# EAGLE board HPG_Solution_v1.0 (EAGLE 9.6.2), part 1 of 2
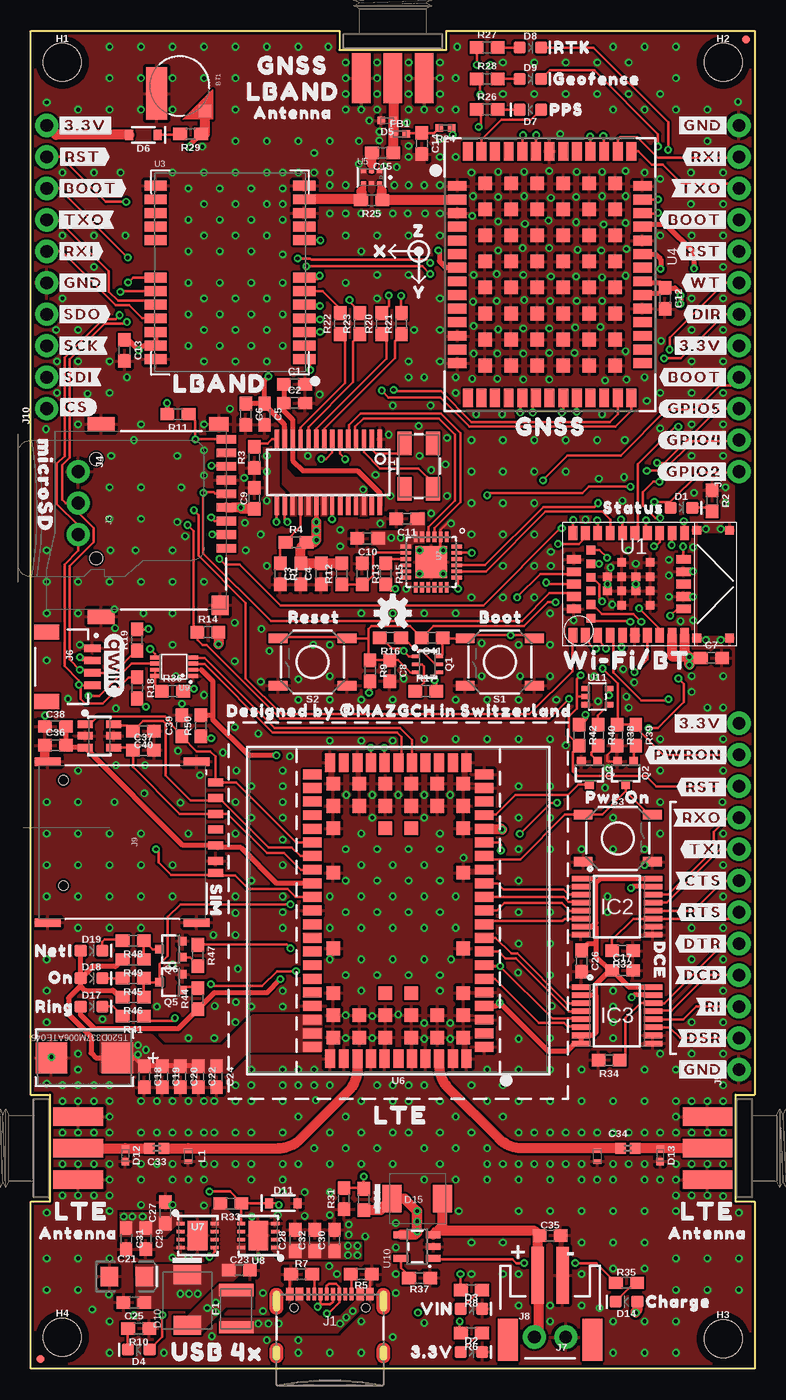
[diagram p2: board, top side]
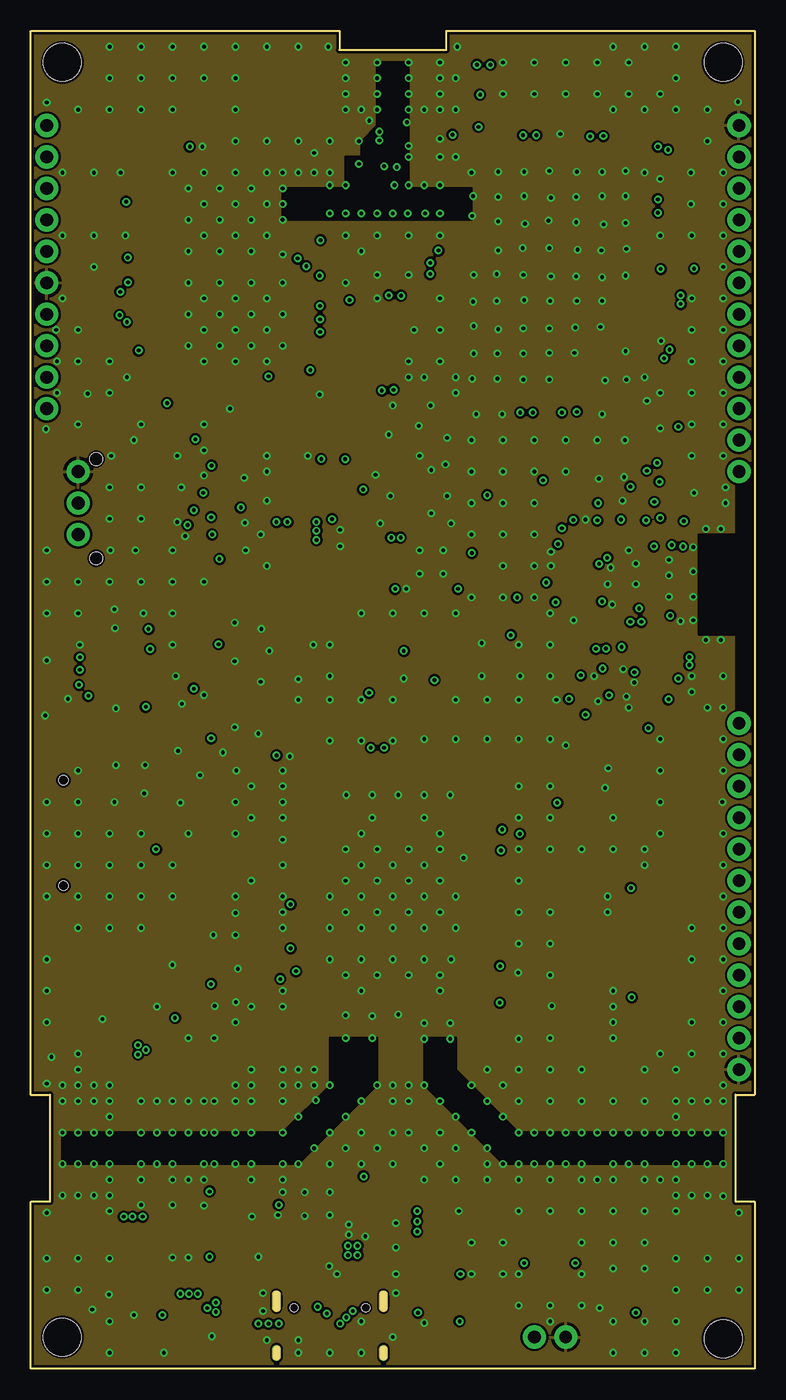
[diagram p3: board, inner layer Route2]
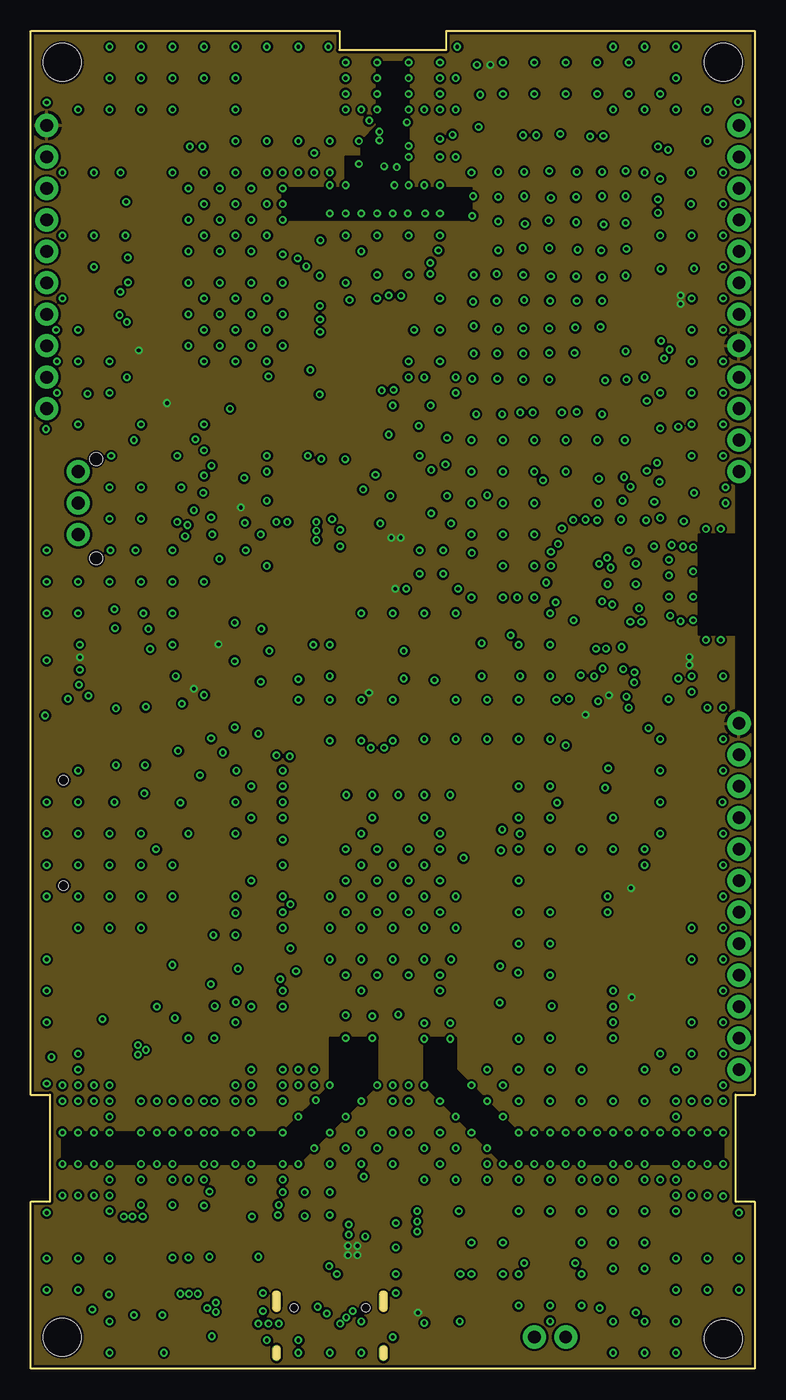
[diagram p4: board, inner layer Route15]
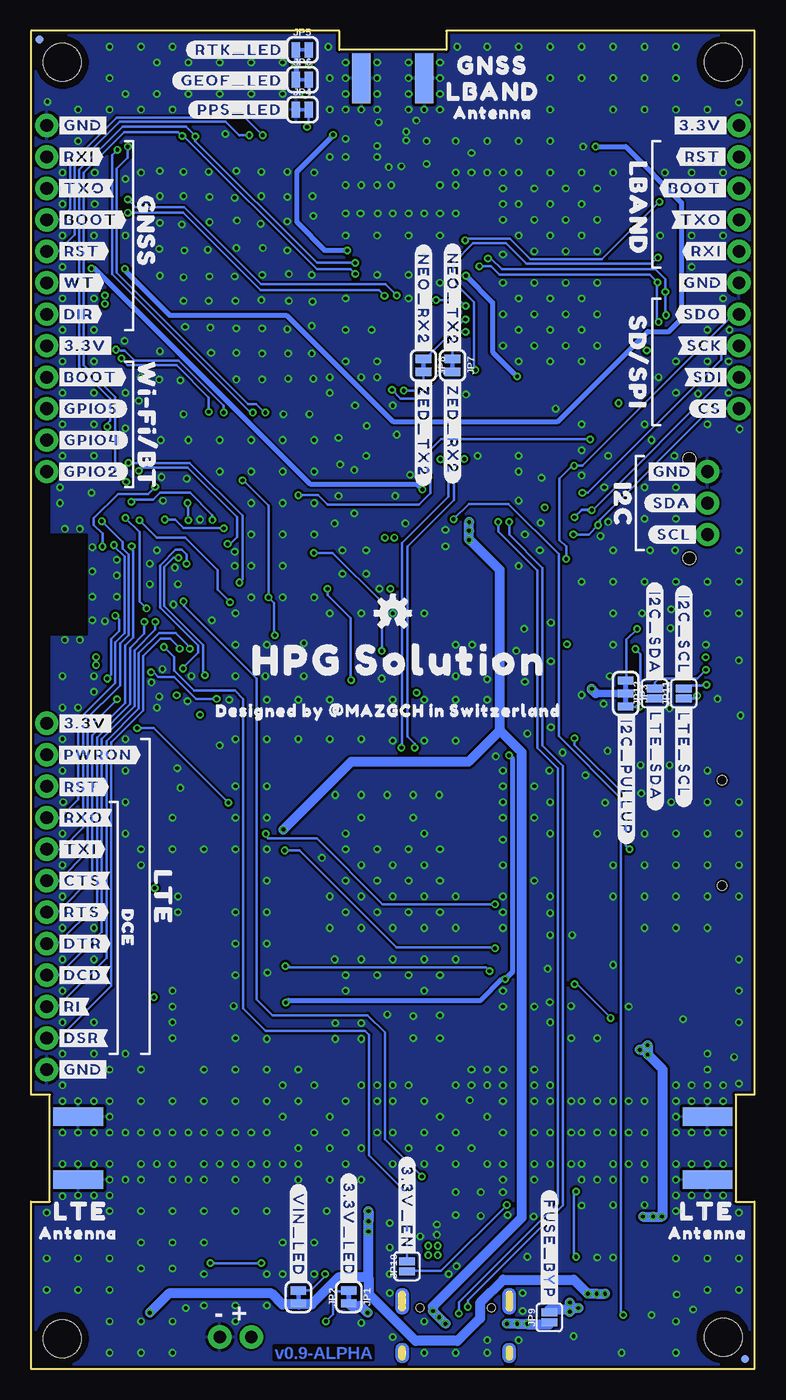
[diagram p5: board, bottom side, seen from below]

Size 58.42 x 107.95 mm. Coordinates in mm from the lower left corner, seen from the top.
Outline: 0,0 0,13.46 1.52,13.46 1.52,22.1 0,22.1 0,107.95 24.89,107.95 24.89,106.43 33.53,106.43 33.53,107.95 58.42,107.95 58.42,22.1 56.9,22.1 56.9,13.46 58.42,13.46 58.42,0 0,0
Copper layers (1+2*15+16): Top 0.035mm / dielectric 0.2mm / Route2 0.0175mm / dielectric 1.065mm / Route15 0.0175mm / dielectric 0.2mm / Bottom 0.035mm
Design rules "SparkFun-4-layer-1oz-JLCPCB": minimum track width 5mil, minimum drill 0.2mm, track to track 5mil, track to pad 0.2mm, pad to pad 5mil, via to via 0.2mm, smd to smd 0mil, copper to edge 0.2mm, drill to drill 10mil, minimum pad ring 0.13mm, minimum via ring 0.13mm, stop-mask expansion 0.05mm, vias tented up to drill 25mil, thermal gap 10mil
Net classes: 0 default: width 0.203 mm; 1 power: width 0.813 mm; 2 supply: width 0.406 mm; 3 RF: width 0.813 mm, clearance 0.127 mm; 4 DiffPair: width 0.152 mm, clearance 0.178 mm

## Footprints (pad centres in the part's own frame; a part is rotated, then mirrored left to right if it is on the bottom)
ML414H_IV01E = smd 1 x 1: + 2.022,2.032 | smd 4.2 x 1.7: - 0.6,-1.85
0603 = smd 1.1 x 1: 1 -0.85,0; 2 0.85,0
CAPMP7.6X4.3_3.1N_KEM = smd 2.56 x 2.5: 1 -2.672,0; 2 2.672,0
0603@1 = smd 1.1 x 1: 1 -0.85,0; 2 0.85,0
EIA3216 = smd 1.4 x 1.6: + 1.4,0; - -1.4,0
0402 = smd 0.85 x 0.9: 1 -0.58,0; 2 0.58,0
LED-0603 = smd 1 x 1: A -0.877,0; C 0.877,0
0402-TIGHT = smd 0.6 x 0.6: 1 -0.5,0; 2 0.5,0
SOD-323 = smd 0.63 x 0.83: A 1.15,0; C -1.15,0
DO-214BA = smd 1.52 x 2.21: A -2.032,0; C 2.038,0
SOT23-6L = smd 0.6 x 1.2: 1 -0.95,-1.15; 2 0,-1.15; 3 0.95,-1.15; 4 0.95,1.15; 5 0,1.15; 6 -0.95,1.15
SMA-EDGE = smd 1.5 x 4: GND@0 -2.54,0; GND@1 2.54,0; SIG 0,0 | smd 1.5 x 4 bottom: GND@2 -2.54,0; GND@3 2.54,0
1210 = smd 1 x 2.8: 1 -1.5,0; 2 1.5,0
FIDUCIAL-MICRO = smd 0.635 x 0.635: 1 0,0
STAND-OFF-TIGHT = hole 3.048: 0,0
FE1.1S_SSOP-28 = smd 0.35 x 1.5: 1 -4.16,-2.7; 2 -3.52,-2.7; 3 -2.88,-2.7; 4 -2.24,-2.7; 5 -1.6,-2.7; 6 -0.96,-2.7; 7 -0.32,-2.7; 8 0.32,-2.7; 9 0.96,-2.7; 10 1.6,-2.7; 11 2.24,-2.7; 12 2.88,-2.7; 13 3.52,-2.7; 14 4.16,-2.7; 15 4.16,2.7; 16 3.52,2.7; 17 2.88,2.7; 18 2.24,2.7; 19 1.6,2.7; 20 0.96,2.7; 21 0.32,2.7; 22 -0.3,2.7; 23 -0.96,2.7; 24 -1.6,2.7; 25 -2.24,2.7; 26 -2.88,2.7; 27 -3.52,2.7; 28 -4.16,2.7
SOP65P640X120-16N = smd 1.5 x 0.45: 1 -2.9,2.275; 2 -2.9,1.625; 3 -2.9,0.975; 4 -2.9,0.325; 5 -2.9,-0.325; 6 -2.9,-0.975; 7 -2.9,-1.625; 8 -2.9,-2.275; 9 2.9,-2.275; 10 2.9,-1.625; 11 2.9,-0.975; 12 2.9,-0.325; 13 2.9,0.325; 14 2.9,0.975; 15 2.9,1.625; 16 2.9,2.275
USB-C-16P_4LAYER-PADS = smd 0.3 x 1: A5 -1.25,-0.34; A6 -0.25,-0.34; A7 0.25,-0.34; A8 1.25,-0.34; B5 1.75,-0.34; B6 0.75,-0.34; B7 -0.75,-0.34; B8 -1.75,-0.34 | smd 0.6 x 1: GND -3.225,-0.34; GND2 3.225,-0.34; VBUS1 -2.45,-0.34; VBUS2 2.45,-0.34 | drill 0.4 pad 0.6 long: SHLD1 -4.318,-0.915; SHLD2 4.318,-0.915; SHLD3 -4.318,-5.095; SHLD4 4.318,-5.095 | hole 0.65: -2.89,-1.445; 2.89,-1.445
1X12_NO_SILK = drill 1.016 pad 1.88: 1 0,0; 2 2.54,0; 3 5.08,0; 4 7.62,0; 5 10.16,0; 6 12.7,0; 7 15.24,0; 8 17.78,0; 9 20.32,0; 10 22.86,0; 11 25.4,0; 12 27.94,0
MICROSD-EXTERNALPIN = smd 0.7 x 1.6: 1 2.25,10.5; 2 1.15,10.5; 3 0.05,10.5; 4 -1.05,10.5; 5 -2.15,10.5; 6 -3.25,10.5; 7 -4.35,10.5; 8 -5.45,10.5; 9 -6.55,10.5 | smd 1.2 x 1.6: 10 -7.75,9.9 | smd 1.2 x 2.2: 11 -7.75,0.4; 12 7.75,0.4 | smd 1.6 x 1.4: 13 6.85,10 | hole 1: 3.05,0; -4.95,0
1X03_NO_SILK = drill 1.016 pad 1.88: 1 0,0; 2 2.54,0; 3 5.08,0
JST04_1MM_RA = smd 0.6 x 1.35: 1 -1.5,0; 2 -0.5,0; 3 0.5,0; 4 1.5,0 | smd 1.2 x 2: NC1 2.8,-3.675; NC2 -2.8,-3.675
JST-2-SMD = smd 1 x 4.6: 1 -1,-3.7; 2 1,-3.7 | smd 1.6 x 3.4: NC1 -3.4,1.5; NC2 3.4,1.5
1X02_NO_SILK = drill 1.016 pad 1.88: 1 0,0; 2 2.54,0
NANO_SIM_PP = smd 0.7 x 2.1: A1 6.495,6; A2 -6.495,6; A3 -6.495,-6; A4 6.495,-6 | smd 0.65 x 1.23: C1 0.255,7.535; C2 -2.285,7.535; C3 -4.825,7.535; C5 1.525,7.535; C6 -1.015,7.535; C7 -3.555,7.535; CD 2.475,7.535 | hole 0.75: 3.505,-4.75; -4.995,-4.75
1X10_NO_SILK = drill 1.016 pad 1.88: 1 0,0; 2 2.54,0; 3 5.08,0; 4 7.62,0; 5 10.16,0; 6 12.7,0; 7 15.24,0; 8 17.78,0; 9 20.32,0; 10 22.86,0
SMT-JUMPER_2_NC_TRACE_SILK = smd 0.66 x 1.27: 1 -0.521,0; 2 0.521,0
SMT-JUMPER_3_2-NC_TRACE_SILK = smd 0.66 x 1.27: 1 -1.041,0; 2 0,0; 3 1.041,0
SMT-JUMPER_2_NO_SILK = smd 0.635 x 1.27: 1 -0.406,0; 2 0.406,0
0402_COILCRAFT = smd 0.356 x 0.66: P$1 -0.432,0; P$2 0.432,0
SC70-6 = smd 0.3 x 0.66: 1 -0.65,-0.92; 2 0,-0.92; 3 0.65,-0.92; 4 0.65,0.92; 5 0,0.92; 6 -0.65,0.92
SOT323 = smd 0.7 x 0.7: 1 -0.65,-0.925; 2 0.65,-0.925; 3 0,0.925
TACTILE_SWITCH_SMD_5.2MM = smd 1.524 x 0.762: 1 -2.794,1.905; 2 2.794,1.905; 3 -2.794,-1.905; 4 2.794,-1.905
NINA-W106 = smd 0.7 x 1.15: 1 4.95,4.125; 2 3.95,4.125; 3 2.95,4.125; 4 1.95,4.125; 5 0.95,4.125; 6 -0.05,4.125; 7 -1.05,4.125; 8 -2.05,4.125; 9 -3.05,4.125; 10 -4.05,4.125; 16 -4.05,-4.125; 17 -3.05,-4.125; 18 -2.05,-4.125; 19 -1.05,-4.125; 20 -0.05,-4.125; 21 0.95,-4.125; 22 1.95,-4.125; 23 2.95,-4.125; 24 3.95,-4.125; 25 4.95,-4.125 | smd 1.15 x 0.7: 11 -3.975,2; 12 -3.975,1; 13 -3.975,0; 14 -3.975,-1; 15 -3.975,-2; 26 4.875,-2; 27 4.875,-1; 28 4.875,0; 29 4.875,1; 30 4.875,2 | smd 0.7 x 0.7: 31 3.5,2.75; 32 3.5,1.65; 33 3.5,0.55; 34 3.5,-0.55; 35 3.5,-1.65; 36 3.5,-2.75; GND@1 -1.28,1.7; GND@2 -1.28,0.55; GND@3 -1.28,-0.6; GND@4 -1.28,-1.75; GND@5 -0.13,0.55; GND@6 -0.13,-0.6; GND@7 1.02,1.7; GND@8 1.02,0.55; GND@9 1.02,-0.6; GND@10 1.02,-1.75; GND@11 2.17,0.55; GND@12 2.17,-0.6; GND@13 -7.7,4.35; GND@14 -5.05,4.35; GND@15 -7.7,-4.35; GND@16 -5.05,-4.35
QFN24 = smd 0.85 x 0.3: 1 -2.05,1.25; 2 -2.05,0.75; 3 -2.05,0.25; 4 -2.05,-0.25; 5 -2.05,-0.75; 6 -2.05,-1.25; 13 2.05,-1.25; 14 2.05,-0.75; 15 2.05,-0.25; 16 2.05,0.25; 17 2.05,0.75; 18 2.05,1.25 | smd 0.3 x 0.85: 7 -1.25,-2.05; 8 -0.75,-2.05; 9 -0.25,-2.05; 10 0.25,-2.05; 11 0.75,-2.05; 12 1.25,-2.05; 19 1.25,2.05; 20 0.75,2.05; 21 0.25,2.05; 22 -0.25,2.05; 23 -0.75,2.05; 24 -1.25,2.05 | smd 2.55 x 2.55: PAD 0,0
NEO-M9N/M8T/M8U/D9S = smd 1.8 x 0.8: 1 6,-7; 2 6,-5.9; 3 6,-4.8; 4 6,-3.7; 5 6,-2.6; 6 6,-1.5; 7 6,-0.4; 8 6,2.6; 9 6,3.7; 10 6,4.8; 11 6,5.9; 12 6,7; 13 -6,7; 14 -6,5.9; 15 -6,4.8; 16 -6,3.7; 17 -6,2.6; 18 -6,-0.4; 19 -6,-1.5; 20 -6,-2.6; 21 -6,-3.7; 22 -6,-4.8; 23 -6,-5.9; 24 -6,-7
UBLOX_ZED_F9R = smd 1.1 x 1.1: G1 -7.312,-5.37; G2 -5.212,-5.37; G3 -3.112,-5.37; G4 -1.012,-5.37; G5 1.088,-5.37; G6 3.188,-5.37; G7 5.288,-5.37; G8 7.388,-5.37; G9 7.388,-3.27; G10 5.288,-3.27; G11 3.188,-3.27; G12 1.088,-3.27; G13 -1.012,-3.27; G14 -3.112,-3.27; G15 -5.212,-3.27; G16 -7.312,-3.27; G17 -7.312,-1.17; G18 -5.212,-1.17; G19 -3.112,-1.17; G20 -1.012,-1.17; G21 1.088,-1.17; G22 3.188,-1.17; G23 5.288,-1.17; G24 7.388,-1.17; G25 7.388,0.93; G26 5.288,0.93; G27 3.188,0.93; G28 1.088,0.93; G29 -1.012,0.93; G30 -3.112,0.93; G31 -5.212,0.93; G32 -7.312,0.93; G33 -7.312,3.03; G34 -5.212,3.03; G35 -3.112,3.03; G36 -1.012,3.03; G37 1.088,3.03; G38 3.188,3.03; G39 5.288,3.03; G40 7.388,3.03; G41 7.388,5.13; G42 5.288,5.13; G43 3.188,5.13; G44 1.088,5.13; G45 -1.012,5.13; G46 -3.112,5.13; G47 -5.212,5.13; G48 -7.312,5.13 | smd 0.8 x 1.5: P1 -7.112,-7.62; P2 -6.012,-7.62; P3 -4.912,-7.62; P4 -3.812,-7.62; P5 -2.712,-7.62; P6 -1.612,-7.62; P7 -0.512,-7.62; P8 0.588,-7.62; P9 1.688,-7.62; P10 2.788,-7.62; P11 3.888,-7.62; P12 4.988,-7.62; P13 6.088,-7.62; P14 7.188,-7.62; P28 7.188,7.33; P29 6.088,7.33; P30 4.988,7.33; P31 3.888,7.33; P32 2.788,7.33; P33 1.688,7.33; P34 0.588,7.33; P35 -0.512,7.33; P36 -1.612,7.33; P37 -2.712,7.33; P38 -3.812,7.33; P39 -4.912,7.33; P40 -6.012,7.33; P41 -7.112,7.33 | smd 1.5 x 0.8: P15 9.988,-6.77; P16 9.988,-5.67; P17 9.988,-4.57; P18 9.988,-3.47; P19 9.988,-2.37; P20 9.988,-1.27; P21 9.988,-0.17; P22 9.988,0.93; P23 9.988,2.03; P24 9.988,3.13; P25 9.988,4.23; P26 9.988,5.33; P27 9.988,6.43; P42 -9.912,6.43; P43 -9.912,5.33; P44 -9.912,4.23; P45 -9.912,3.13; P46 -9.912,2.03; P47 -9.912,0.93; P48 -9.912,-0.17; P49 -9.912,-1.27; P50 -9.912,-2.37; P51 -9.912,-3.47; P52 -9.912,-4.57; P53 -9.912,-5.67; P54 -9.912,-6.77
PD0922J5050S2HF_ANA = smd 0.41 x 0.33: 1 0.65,0.483; 2 0,0.483; 3 -0.65,0.483; 4 -0.65,-0.483; 5 0,-0.483; 6 0.65,-0.483
LARA-LGA = smd 0.8 x 1.5: 1 -11,-6.95; 2 -9.9,-6.95; 3 -8.8,-6.95; 4 -7.7,-6.95; 5 -6.6,-6.95; 6 -5.5,-6.95; 7 -4.4,-6.95; 8 -3.3,-6.95; 9 -2.2,-6.95; 10 -1.1,-6.95; 11 0,-6.95; 12 1.1,-6.95; 13 2.2,-6.95; 14 3.3,-6.95; 15 4.4,-6.95; 16 5.5,-6.95; 17 6.6,-6.95; 18 7.7,-6.95; 19 8.8,-6.95; 20 9.9,-6.95; 21 11,-6.95; 33 11,6.95; 34 9.9,6.95; 35 8.8,6.95; 36 7.7,6.95; 37 6.6,6.95; 38 5.5,6.95; 39 4.4,6.95; 40 3.3,6.95; 41 2.2,6.95; 42 1.1,6.95; 43 0,6.95; 44 -1.1,6.95; 45 -2.2,6.95; 46 -3.3,6.95; 47 -4.4,6.95; 48 -5.5,6.95; 49 -6.6,6.95; 50 -7.7,6.95; 51 -8.8,6.95; 52 -9.9,6.95; 53 -11,6.95 | smd 1.5 x 0.8: 22 11.95,-5.5; 23 11.95,-4.4; 24 11.95,-3.3; 25 11.95,-2.2; 26 11.95,-1.1; 27 11.95,0; 28 11.95,1.1; 29 11.95,2.2; 30 11.95,3.3; 31 11.95,4.4; 32 11.95,5.5; 54 -11.95,5.5; 55 -11.95,4.4; 56 -11.95,3.3; 57 -11.95,2.2; 58 -11.95,1.1; 59 -11.95,0; 60 -11.95,-1.1; 61 -11.95,-2.2; 62 -11.95,-3.3; 63 -11.95,-4.4; 64 -11.95,-5.5 | smd 1.1 x 1.1: 65 -10.25,-5.25; 66 -10.25,-3.15; 67 -10.25,-1.05; 68 -10.25,1.05; 69 -10.25,3.15; 70 -10.25,5.25; 71 -8.45,-5.25; 72 -8.45,-3.15; 73 -8.45,-1.05; 74 -8.45,1.05; 75 -8.45,3.15; 76 -8.45,5.25; 77 -6.65,-5.25; 78 -6.65,5.25; 79 -3.05,-5.25; 80 -3.05,5.25; 81 3.05,-5.25; 82 3.05,5.25; 83 6.65,-5.25; 84 6.65,5.25; 85 8.45,-5.25; 86 8.45,-3.15; 87 8.45,-1.05; 88 8.45,1.05; 89 8.45,3.15; 90 8.45,5.25; 91 10.25,-5.25; 92 10.25,-3.15; 93 10.25,-1.05; 94 10.25,1.05; 95 10.25,3.15; 96 10.25,5.25; 97 -6.65,-1.05; 98 -6.65,1.05; 99 6.65,-1.05; 100 6.65,1.05
UDFN-8 = smd 0.3 x 0.65: 1 -0.975,-1.375; 2 -0.325,-1.375; 3 0.325,-1.375; 4 0.975,-1.375; 5 0.975,1.375; 6 0.325,1.375; 7 -0.325,1.375; 8 -0.975,1.375 | smd 2.35 x 1.6: EP 0,0
VSSOP_8PIN = smd 0.8 x 0.3: P1 -1.55,0.75; P2 -1.55,0.25; P3 -1.55,-0.25; P4 -1.55,-0.75; P5 1.55,-0.75; P6 1.55,-0.25; P7 1.55,0.25; P8 1.55,0.75
SOT23-5 = smd 0.55 x 1.2: 1 -0.95,-1.3; 2 0,-1.3; 3 0.95,-1.3; 4 0.95,1.3; 5 -0.95,1.3
SOT353 = smd 0.42 x 0.7: 1 -0.65,-0.95; 2 0,-0.95; 3 0.65,-0.95; 4 0.65,0.95; 5 -0.65,0.95
CRYSTAL-SMD-5X3.2-4PAD = smd 1.9 x 1.1: 1 -1.85,-1.15; 2 1.85,-1.15; 3 1.85,1.15; 4 -1.85,1.15

## Placement (x,y rotation side)
BT1  ML414H_IV01E_BATTERY  [ML414H_IV01E]  12,103.5 270 top
C1  1.0uF  [0603]  21.27,79.44 0 top
C2  0.1uF  [0603]  21.27,77.91 0 top
C3  1.0uF  [0603]  21.78,64.14 90 top
C4  0.1uF  [0603]  23.43,64.14 90 top
C5  1.0uF  [0603]  18.86,77.03 270 top
C6  0.1uF  [0603]  17.34,77.03 270 top
C7  1.0uF  [0603]  54.93,57.34 0 top
C8  1nF  [0603]  28.96,56.32 270 top
C9  0.1uF  [0603]  18.03,70.23 90 top
C10  4.7uF  [0603]  27.18,66.99 180 top
C11  0.1uF  [0603]  30.35,68.58 180 top
C12  1.0uF  [0603]  51.18,86.36 270 top
C13  1.0uF  [0603]  7.56,82.17 270 top
C14  47pF  [0603]  31.56,98.87 270 top
C15  47pF  [0603]  28.38,98.11 180 top
C16  T520D337M006ATE045  [CAPMP7.6X4.3_3.1N_KEM]  4.32,25.08 180 top
C17  0.1uF  [0603]  47.75,32.13 0 top
C18  10uF  [0603]  9.14,23.56 270 top
C19  0.1uF  [0603]  10.6,23.56 270 top
C20  68pF  [0603@1]  12.06,23.56 270 top
C21  10uF  [EIA3216]  7.75,7.43 0 top
C22  15pF  [0603]  13.53,23.56 270 top
C23  0.22uF  [0603]  16.83,7.94 0 top
C24  8.2pF  [0603]  14.99,23.56 270 top
C25  0.1uF  [0603]  8.32,5.33 180 top
C26  0.1uF  [0603]  44.45,32.89 270 top
C27  4.7uF  [0603]  10.86,12.57 90 top
C28  4.7uF  [0603]  21.34,10.35 90 top
C29  0.22uF  [0603]  9.27,10.48 270 top
C30  0.22uF  [0603]  24.51,10.35 90 top
C31  0.1uF  [0603]  7.68,10.48 270 top
C32  0.1uF  [0603]  22.92,10.35 90 top
C33  33pF  [0402]  10.16,17.78 180 top
C34  33pF  [0402]  48.2,17.78 0 top
C35  4.7uF  [0603]  41.91,10.73 0 top
C36  0.1uF  [0603]  1.97,50.29 0 top
C37  47pF  [0603]  9.08,49.91 0 top
C38  47pF  [0603]  1.97,51.82 0 top
C39  47pF  [0603]  12.19,51.88 90 top
C40  47pF  [0603]  9.08,51.44 180 top
C41  DNP  [0603]  32.38,58.99 180 top
D1  BLUE  [LED-0603]  52.51,69.47 0 top
D2  Yellow  [LED-0603]  35.56,1.33 0 top
D3  RED  [LED-0603]  35.56,4.83 0 top
D4  BLUE  [LED-0603]  8.7,1.52 180 top
D5  PESD0402-0402T  [0402-TIGHT]  28.77,100.71 180 top
D6  0.5A/40V/420mV  [SOD-323]  9.08,99.57 180 top
D7  BLUE  [LED-0603]  40.32,101.6 180 top
D8  GREEN  [LED-0603]  40.32,106.62 0 top
D9  RED  [LED-0603]  40.32,104.08 0 top
D10  1A/15V/220mV  [DO-214BA]  12.64,5.52 90 top
D11  3.3V  [SOD-323]  20.38,13.34 0 top
D12  PESD0402-0402T  [0402-TIGHT]  7.62,17.21 270 top
D13  PESD0402-0402T  [0402-TIGHT]  50.8,17.21 270 top
D14  RED  [LED-0603]  48.07,5.4 180 top
D15  1A/15V/220mV  [DO-214BA]  31.18,13.72 180 top
D16  DT1042-04SO-7  [SOT23-6L]  5.52,51.05 270 top
D17  RED  [LED-0603]  4.89,29.21 0 top
D18  GREEN  [LED-0603]  4.89,31.5 0 top
D19  BLUE  [LED-0603]  4.89,33.72 0 top
E1  SMA  [SMA-EDGE]  29.21,104.14 0 top
E2  SMA  [SMA-EDGE]  3.81,17.78 90 top
E3  SMA  [SMA-EDGE]  54.61,17.78 270 top
F1  6V/2A  [1210]  16.57,4.83 90 top
FB1  2.66Ω  [0402-TIGHT]  29.78,99.63 0 top
FD1  FIDUCIALUFIDUCIAL  [FIDUCIAL-MICRO]  0.76,0.76 0 bottom
FD2  FIDUCIALUFIDUCIAL  [FIDUCIAL-MICRO]  57.72,107.25 0 bottom
FD3  FIDUCIALUFIDUCIAL  [FIDUCIAL-MICRO]  57.72,107.25 0 top
FD4  FIDUCIALUFIDUCIAL  [FIDUCIAL-MICRO]  0.76,0.76 0 top
FRAME1  FRAME-LEDGER  [CREATIVE_COMMONS]  10.16,118.11 0 top  (outside the outline)
FRAME2  FRAME-LEDGER  [CREATIVE_COMMONS]  10.16,118.11 0 top  (outside the outline)
FRAME3  FRAME-LEDGER  [CREATIVE_COMMONS]  10.16,118.11 0 top  (outside the outline)
H1  STAND-OFFTIGHT  [STAND-OFF-TIGHT]  2.54,105.41 0 top
H2  STAND-OFFTIGHT  [STAND-OFF-TIGHT]  55.88,105.41 0 top
H3  STAND-OFFTIGHT  [STAND-OFF-TIGHT]  55.88,2.41 0 top
H4  STAND-OFFTIGHT  [STAND-OFF-TIGHT]  2.54,2.54 0 top
IC1  FE1.1S  [FE1.1S_SSOP-28]  24,72.33 180 top
IC2  SN74AVC4T774PW  [SOP65P640X120-16N]  47.31,37.27 0 top
IC3  SN74AVC4T774PW  [SOP65P640X120-16N]  47.31,28.51 0 top
J1  [USB-C-16P_4LAYER-PADS]  24.13,6.35 0 top
J2  [1X12_NO_SILK]  57.15,72.39 90 top
J3  MICRO-SD-PUSH-PUSH-EXT-PIN  [MICROSD-EXTERNALPIN]  5.27,68.45 270 top
J4  [1X03_NO_SILK]  3.81,72.39 270 top
J5  [1X12_NO_SILK]  57.15,24.13 90 top
J6  QWIIC_RIGHT_ANGLE  [JST04_1MM_RA]  4.95,56.64 270 top
J7  [JST-2-SMD]  41.91,3.81 180 top
J8  [1X02_NO_SILK]  40.64,2.54 0 top
J9  NANO_SIM  [NANO_SIM_PP]  7.37,42.48 270 top
J10  [1X10_NO_SILK]  1.27,77.47 90 top
JP1  [SMT-JUMPER_2_NC_TRACE_SILK]  32.77,5.78 270 bottom
JP2  [SMT-JUMPER_2_NC_TRACE_SILK]  36.83,5.78 270 bottom
JP3  [SMT-JUMPER_3_2-NC_TRACE_SILK]  10.41,54.48 270 bottom
JP4  JUMPER-SMT_2_NC_TRACE_SILK  [SMT-JUMPER_2_NC_TRACE_SILK]  36.51,101.6 0 bottom
JP5  JUMPER-SMT_2_NC_TRACE_SILK  [SMT-JUMPER_2_NC_TRACE_SILK]  36.51,106.43 0 bottom
JP6  JUMPER-SMT_2_NC_TRACE_SILK  [SMT-JUMPER_2_NC_TRACE_SILK]  36.51,104.01 0 bottom
JP7  JUMPER-SMT_2_NC_TRACE_SILK  [SMT-JUMPER_2_NC_TRACE_SILK]  24.38,80.96 270 bottom
JP8  JUMPER-SMT_2_NC_TRACE_SILK  [SMT-JUMPER_2_NC_TRACE_SILK]  26.73,80.96 270 bottom
JP9  [SMT-JUMPER_2_NO_SILK]  16.57,4.13 90 bottom
JP10  [SMT-JUMPER_2_NO_SILK]  28.07,8.26 270 bottom
JP11  [SMT-JUMPER_2_NO_SILK]  5.71,54.48 90 bottom
JP12  [SMT-JUMPER_2_NO_SILK]  8.06,54.48 90 bottom
L1  DNP  [0402_COILCRAFT]  12.7,17.14 270 top
L2  DNP  [0402_COILCRAFT]  45.72,17.14 270 top
Q1  MBT3904DW1T1  [SC70-6]  32,56.83 270 top
Q2  310mA/60V/1.6Ω  [SOT323]  48.01,48.07 180 top
Q3  310mA/60V/1.6Ω  [SOT323]  45.09,48.07 180 top
Q5  310mA/60V/1.6Ω  [SOT323]  11.3,31.18 90 top
Q6  310mA/60V/1.6Ω  [SOT323]  11.3,33.85 90 top
R1  100k  [0603]  20.13,64.14 270 top
R2  1k  [0603]  54.99,70.04 270 top
R3  2.7k  [0603]  18.03,73.53 90 top
R4  47k  [0603]  21.4,66.67 0 top
R5  5.1k  [0603]  26.67,7.62 180 top
R6  1k  [0603]  35.56,2.86 180 top
R7  5.1k  [0603]  21.84,7.62 0 top
R8  4.7k  [0603]  35.56,6.35 180 top
R9  100k  [0603]  27.37,56.32 270 top
R10  1k  [0603]  8.7,3.24 180 top
R11  100k  [0603]  11.87,77.03 180 top
R12  22k  [0603]  25.08,64.14 90 top
R13  33k  [0603]  26.73,64.14 270 top
R14  100k  [0603]  14.29,59.44 0 top
R15  2.2k  [0603]  28.64,64.14 270 top
R16  10k  [0603]  29.02,58.99 180 top
R17  10k  [0603]  31.88,54.67 0 top
R18  2.2k  [0603]  8.57,54.93 270 top
R19  2.2k  [0603]  8.57,58.8 90 top
R20  27  [0603]  28.32,84.33 90 top
R21  27  [0603]  29.91,84.33 90 top
R22  27  [0603]  24.96,84.33 90 top
R23  27  [0603]  26.54,84.33 90 top
R24  10Ω  [0402-TIGHT]  33.46,100.14 180 top
R25  100  [0603]  27.5,94.3 180 top
R26  1k  [0603]  36.83,101.6 0 top
R27  1k  [0603]  36.83,106.62 0 top
R28  1k  [0603]  36.83,104.08 0 top
R29  1k  [0603]  12.89,99.63 180 top
R30  22k  [0603]  26.86,13.65 270 top
R31  33k  [0603]  25.27,13.72 90 top
R32  100k  [0603]  47.75,33.72 180 top
R33  100k  [0603]  16.13,13.34 180 top
R34  100k  [0603]  46.67,24.89 180 top
R35  1k  [0603]  48.07,6.92 0 top
R36  200k  [0603]  11.43,54.67 0 top
R37  2.2k  [0603]  31.37,7.3 180 top
R38  100k  [0603]  47.31,51.12 270 top
R39  1k  [0603]  48.83,51.12 270 top
R40  1k  [0603]  45.78,51.12 270 top
R41  220  [0603]  8.26,28.45 180 top
R42  100k  [0603]  44.26,51.12 270 top
R44  1k  [0603]  13.46,29.84 90 top
R45  100  [0603]  8.26,31.5 180 top
R46  100k  [0603]  8.26,29.97 180 top
R47  1k  [0603]  13.46,33.34 270 top
R48  1k  [0603]  8.26,34.54 180 top
R49  100k  [0603]  8.26,33.02 180 top
R50  1k  [0603]  13.72,51.88 90 top
S1  BOOT  [TACTILE_SWITCH_SMD_5.2MM]  37.85,57.02 180 top
S2  RESET  [TACTILE_SWITCH_SMD_5.2MM]  22.73,57.02 180 top
S3  PWR_ON  [TACTILE_SWITCH_SMD_5.2MM]  47.37,42.8 0 top
U1  [NINA-W106]  48.7,63.31 180 top
U2  CP210X  [QFN24]  32.32,65.09 270 top
U3  U-BLOX_NEO-D9S-00B  [NEO-M9N/M8T/M8U/D9S]  16.07,88.46 0 top
U4  U-BLOX_ZED_F9R  [UBLOX_ZED_F9R]  42.04,88.33 270 top
U5  POWER-DIVIDER  [PD0922J5050S2HF_ANA]  27.5,96.14 0 top
U6  LARA-R6001  [LARA-LGA]  29.65,36.96 90 top
U7  AP7361C-33FGE  [UDFN-8]  13.46,10.73 270 top
U8  AP7361C-33FGE  [UDFN-8]  18.35,10.73 90 top
U9  PCA9306  [VSSOP_8PIN]  11.56,56.64 180 top
U10  MCP73831  [SOT23-5]  31.18,9.84 90 top
U11  74HC1G04  [SOT353]  45.72,54.23 270 top
U$1  [OSHW-LOGO-S]  29.21,60.96 0 top
U$2  [QWIIC_5MM]  6.73,56.77 270 top
U$3  [MICROSD0]  1.14,75.88 270 top
U$4  [LTE0]  4.06,12.7 0 top
U$5  [LTE0]  54.61,12.7 0 top
U$6  [GNSS0]  41.97,76.01 0 top
U$7  [#PWRON#1]  53.02,49.53 0 top
U$8  [#GND#0]  1.97,87.63 0 top
U$9  [#GND#0]  52.01,100.33 0 top
U$10  [#GND#0]  52.01,24.13 0 top
U$11  [#3#3V#0]  54.04,82.55 0 top
U$12  [#3#3V#0]  54.04,52.07 0 top
U$13  [#3#3V#0]  4.38,100.33 0 top
U$14  [#RST#2]  54.29,46.93 0 bottom
U$15  [RESET6]  20.07,60.64 0 top
U$16  [BOOT5]  35.5,60.64 0 top
U$17  [PWR_ON0]  47.37,46.1 0 top
U$18  [#RST#3]  54.29,46.93 0 top
U$19  [LTE0]  29.84,20.45 0 top
U$20  [GNSS0]  21.15,105.16 0 top
U$21  [CHARGE0]  52.26,5.4 0 top
U$22  [#RST#3]  54.29,90.17 0 top
U$23  [#RTK_LED#0]  41.66,106.43 0 bottom
U$24  [#3#3V_LED#0]  32.77,11.24 270 bottom
U$25  [3#3V3]  32.38,1.33 0 top
U$26  [RTK16]  43.69,106.62 0 top
U$27  [#I2C_SCL#2]  5.71,59.25 270 bottom
U$28  [PPS14]  43.24,101.6 0 top
U$29  [#I2C_PULLUP#3]  10.35,53.09 270 bottom
U$30  [#RXI#1]  56.45,97.79 0 top
U$31  [ON0]  2.41,31.56 0 top
U$32  [#TXO#5]  4.32,92.71 0 top
U$33  [#TXO#5]  54.1,95.25 0 bottom
U$34  [#CS#4]  5.27,77.47 0 bottom
U$35  [#RST#3]  4.19,97.79 0 bottom
U$36  [#3#3V#0]  54.04,52.07 0 bottom
U$37  [#GND#0]  56.45,24.13 0 bottom
U$38  [#RXI#0]  56.45,97.79 0 bottom
U$39  [#3#3V#0]  54.04,82.55 0 bottom
U$40  [#GND#0]  56.45,100.33 0 bottom
U$41  [#3#3V#0]  4.38,100.33 0 bottom
U$42  [#GEOF_LED#1]  42.23,103.95 0 bottom
U$43  [#GND#0]  6.41,87.63 0 bottom
U$44  [LTE0]  3.87,12.7 0 bottom
U$45  [LTE0]  54.42,12.7 0 bottom
U$46  [GNSS0]  21.15,105.16 0 bottom
U$47  [X1]  26.99,90.17 0 top
U$48  [Y2]  30.16,86.87 0 top
U$49  [#I2C_SDA#1]  8.06,59.37 270 bottom
U$50  [HPG_SOLUTION0]  28.7,57.15 0 bottom
U$51  [SIM0]  14.92,37.78 270 top
U$52  [Z0]  30.16,91.82 0 top
U$53  [#BOOT#1]  56.45,80.01 0 bottom
U$54  [VIN3]  32.77,4.83 0 top
U$55  [I2C0]  10.67,72.52 270 bottom
U$56  [#PWRON#0]  53.02,49.53 0 bottom
U$57  [#BOOT#0]  56.45,80.01 0 top
U$58  [#TXO#3]  1.97,92.71 0 bottom
U$59  [#RXI#1]  1.97,90.17 0 bottom
U$60  [#RXI#0]  1.97,90.17 0 top
U$61  [#TXO#3]  56.45,95.25 0 top
U$62  [#PPS_LED#2]  41.59,101.6 0 bottom
U$63  [#GPIO4#1]  56.45,74.93 0 top
U$64  [#GPIO2#2]  56.45,72.39 0 top
U$65  [#GPIO2#8]  50.61,72.39 0 bottom
U$66  [#DIR#13]  56.45,85.09 0 top
U$67  [#WT#11]  56.45,87.63 0 top
U$68  [#WT#10]  56.45,87.63 0 bottom
U$69  [#DIR#12]  56.45,85.09 0 bottom
U$70  [#GPIO4#7]  50.61,74.93 0 bottom
U$71  [#GPIO5#6]  50.67,77.47 0 bottom
U$72  [#BOOT#0]  56.45,92.71 0 top
U$73  [DCE0]  50.61,35.56 270 bottom
U$74  [#BOOT#0]  1.97,95.25 0 bottom
U$75  [#BOOT#1]  1.97,95.25 0 top
U$76  [#BOOT#1]  56.45,92.71 0 bottom
U$77  [LBAND2]  21.15,103.06 0 top
U$78  [LBAND2]  15.24,79.5 0 top
U$79  [USB_4X3]  15.05,1.33 0 top
U$80  [RING0]  1.91,29.21 0 top
U$81  [STATUS7]  48.64,69.47 0 top
U$82  [LBAND2]  21.15,103.06 0 bottom
U$83  [#LTE_SCL#7]  5.71,49.53 270 bottom
U$84  [ANTENNA2]  3.81,10.92 0 top
U$85  [ANTENNA2]  3.81,10.92 0 bottom
U$86  [ANTENNA2]  54.61,10.92 0 top
U$87  [ANTENNA2]  54.61,10.92 0 bottom
U$88  [ANTENNA2]  21.15,101.35 0 top
U$89  [ANTENNA2]  21.15,101.35 0 bottom
U$90  [WI#FI#BT3]  48.13,57.15 0 top
U$91  [#3#3V_EN#1]  28.07,13.02 270 bottom
U$92  [#CTS#5]  56.45,39.37 0 bottom
U$93  [#DCD#4]  56.45,31.75 0 bottom
U$94  [#FUSE_BYP#2]  16.57,9.65 270 bottom
U$95  [#DSR#3]  56.45,26.67 0 bottom
U$96  [#DTR#7]  56.45,34.29 0 bottom
U$97  [#RI#6]  56.45,29.21 0 bottom
U$98  [#RXO#2]  56.45,44.45 0 bottom
U$99  [#RTS#8]  56.45,36.83 0 bottom
U$100  [#TXI#1]  56.45,41.91 0 bottom
U$101  [#RXO#3]  56.45,44.45 0 top
U$102  [#TXI#2]  56.45,41.91 0 top
U$103  [#CTS#6]  56.45,39.37 0 top
U$104  [#RTS#9]  56.45,36.83 0 top
U$105  [#DTR#8]  56.45,34.29 0 top
U$106  [#DCD#5]  56.45,31.75 0 top
U$107  [#RI#7]  56.45,29.21 0 top
U$108  [#DSR#4]  56.45,26.67 0 top
U$109  [#SCK#0]  1.97,82.55 0 top
U$110  [#NEO_RX2#0]  26.73,86.3 270 bottom
U$111  [#NEO_TX2#2]  24.38,86.3 270 bottom
U$112  [#ZED_RX2#3]  24.38,75.76 270 bottom
U$113  [#ZED_TX2#1]  26.73,75.63 270 bottom
U$114  [DCE0]  50.74,32.96 270 top
U$115  [#GPIO5#0]  56.45,77.47 0 top
U$116  [GNSS0]  49.15,91.76 270 bottom
U$117  [LBAND2]  9.4,93.66 270 bottom
U$118  [LTE0]  47.75,38.04 270 bottom
U$119  [WI#FI#BT3]  49.09,76.07 270 bottom
U$120  [DESIGNED_BY_#MAZGCH_IN_SWITZERLAND3]  29.59,53.09 0 bottom
U$121  [DESIGNED_BY_#MAZGCH_IN_SWITZERLAND3]  29.72,53.09 0 top
U$122  [OSHW-LOGO-S]  29.21,60.96 0 bottom
U$123  [#LTE_SDA#5]  8,49.4 270 bottom
U$124  [#SCK#4]  6.16,82.55 0 bottom
U$125  [GEOFENCE5]  41.47,104.08 0 top
U$126  [#RST#2]  54.29,90.17 0 bottom
U$127  [#RST#2]  4.19,97.79 0 top
U$128  [#SDI#1]  1.97,80.01 0 top
U$129  [#VIN_LED#4]  36.83,10.79 270 bottom
U$130  [#SDO#2]  1.97,85.09 0 top
U$131  [#CS#3]  2.03,77.6 0 top
U$132  [#SDI#5]  5.65,80.01 0 bottom
U$133  [#SDO#6]  6.41,85.09 0 bottom
U$134  [SD#SPI8]  9.46,85.98 270 bottom
U$135  [NETI9]  -0.38,33.72 0 top
U$136  [#SCL#11]  8.57,67.31 0 bottom
U$137  [#SDA#12]  8.89,69.85 0 bottom
U$138  [#GND#0]  8.89,72.39 0 bottom
Y1  12MHz  [CRYSTAL-SMD-5X3.2-4PAD]  31.31,72.83 90 top